# Altium schematic sheet A2541WV-7P_2021-01-11.schdoc
size 52 x 30 mm
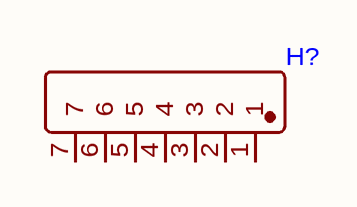
[diagram p0: A2541WV-7P_2021-01-11.schdoc]

## Parts
H?  (no value)  [HDR-TH_7P-P2.54-V]

## Nets

Not connected (* = marked no-connect by the designer): H? 1 2 3 4 5 6 7

## Library data of the parts
H? = A2541WV-7P